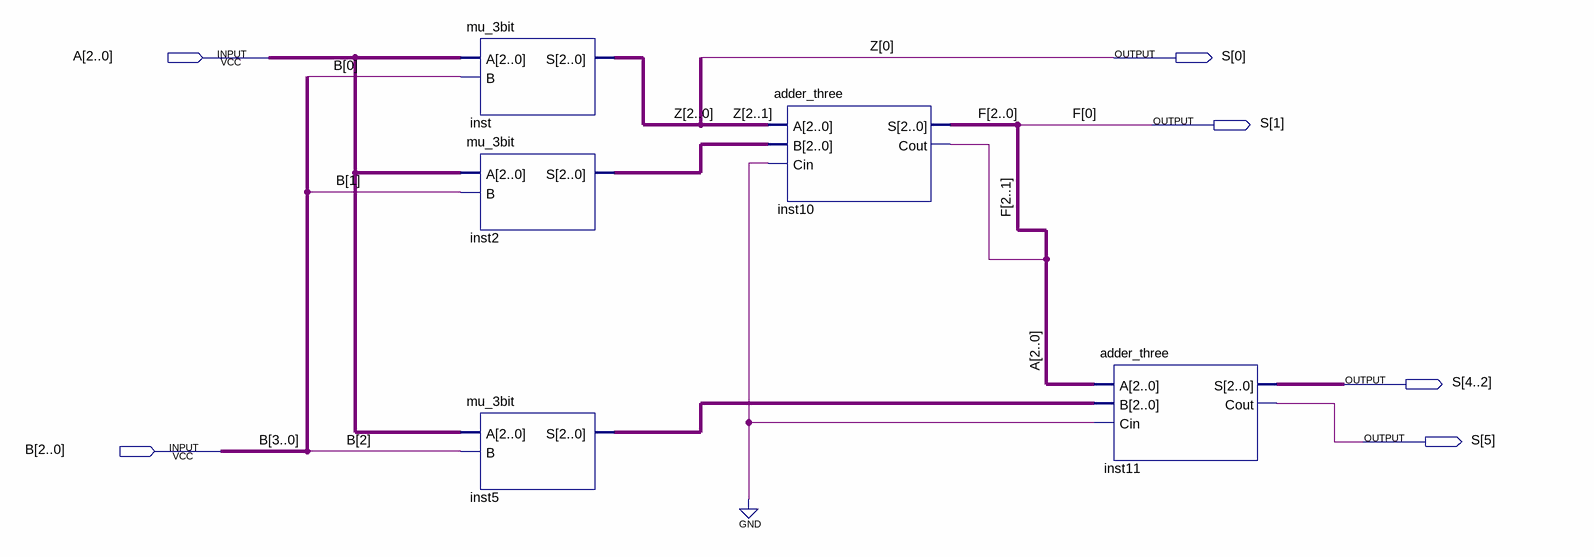
[diagram p0: schematic sheet]
// Quartus schematic 3bit_mu.bdf as structural Verilog: 5 symbols, 6 pins
module \3bit_mu  (
  input  [2:0] A,
  input  [2:0] B,
  output [5:0] S
);

  wire inst10_cout;
  wire [2:0] inst2_s, inst5_s;
  wire [2:1] F, Z;

  mu_3bit inst (.A(A), .B(B[0]), .S({Z, S[0]}));
  mu_3bit inst2 (.A(A), .B(B[1]), .S(inst2_s));
  mu_3bit inst5 (.A(A), .B(B[2]), .S(inst5_s));
  adder_three inst10 (.A(Z), .B(inst2_s), .Cin(1'b0), .S({F, S[1]}), .Cout(inst10_cout));
  adder_three inst11 (.A(A), .B(inst5_s), .Cin(1'b0), .S(S[4:2]), .Cout(S[5]));

  // Other names for the same wires on the sheet: F[0] = S[1]; Z[0] = S[0]
endmodule
